# EAGLE schematic single_channel (EAGLE 6.1)
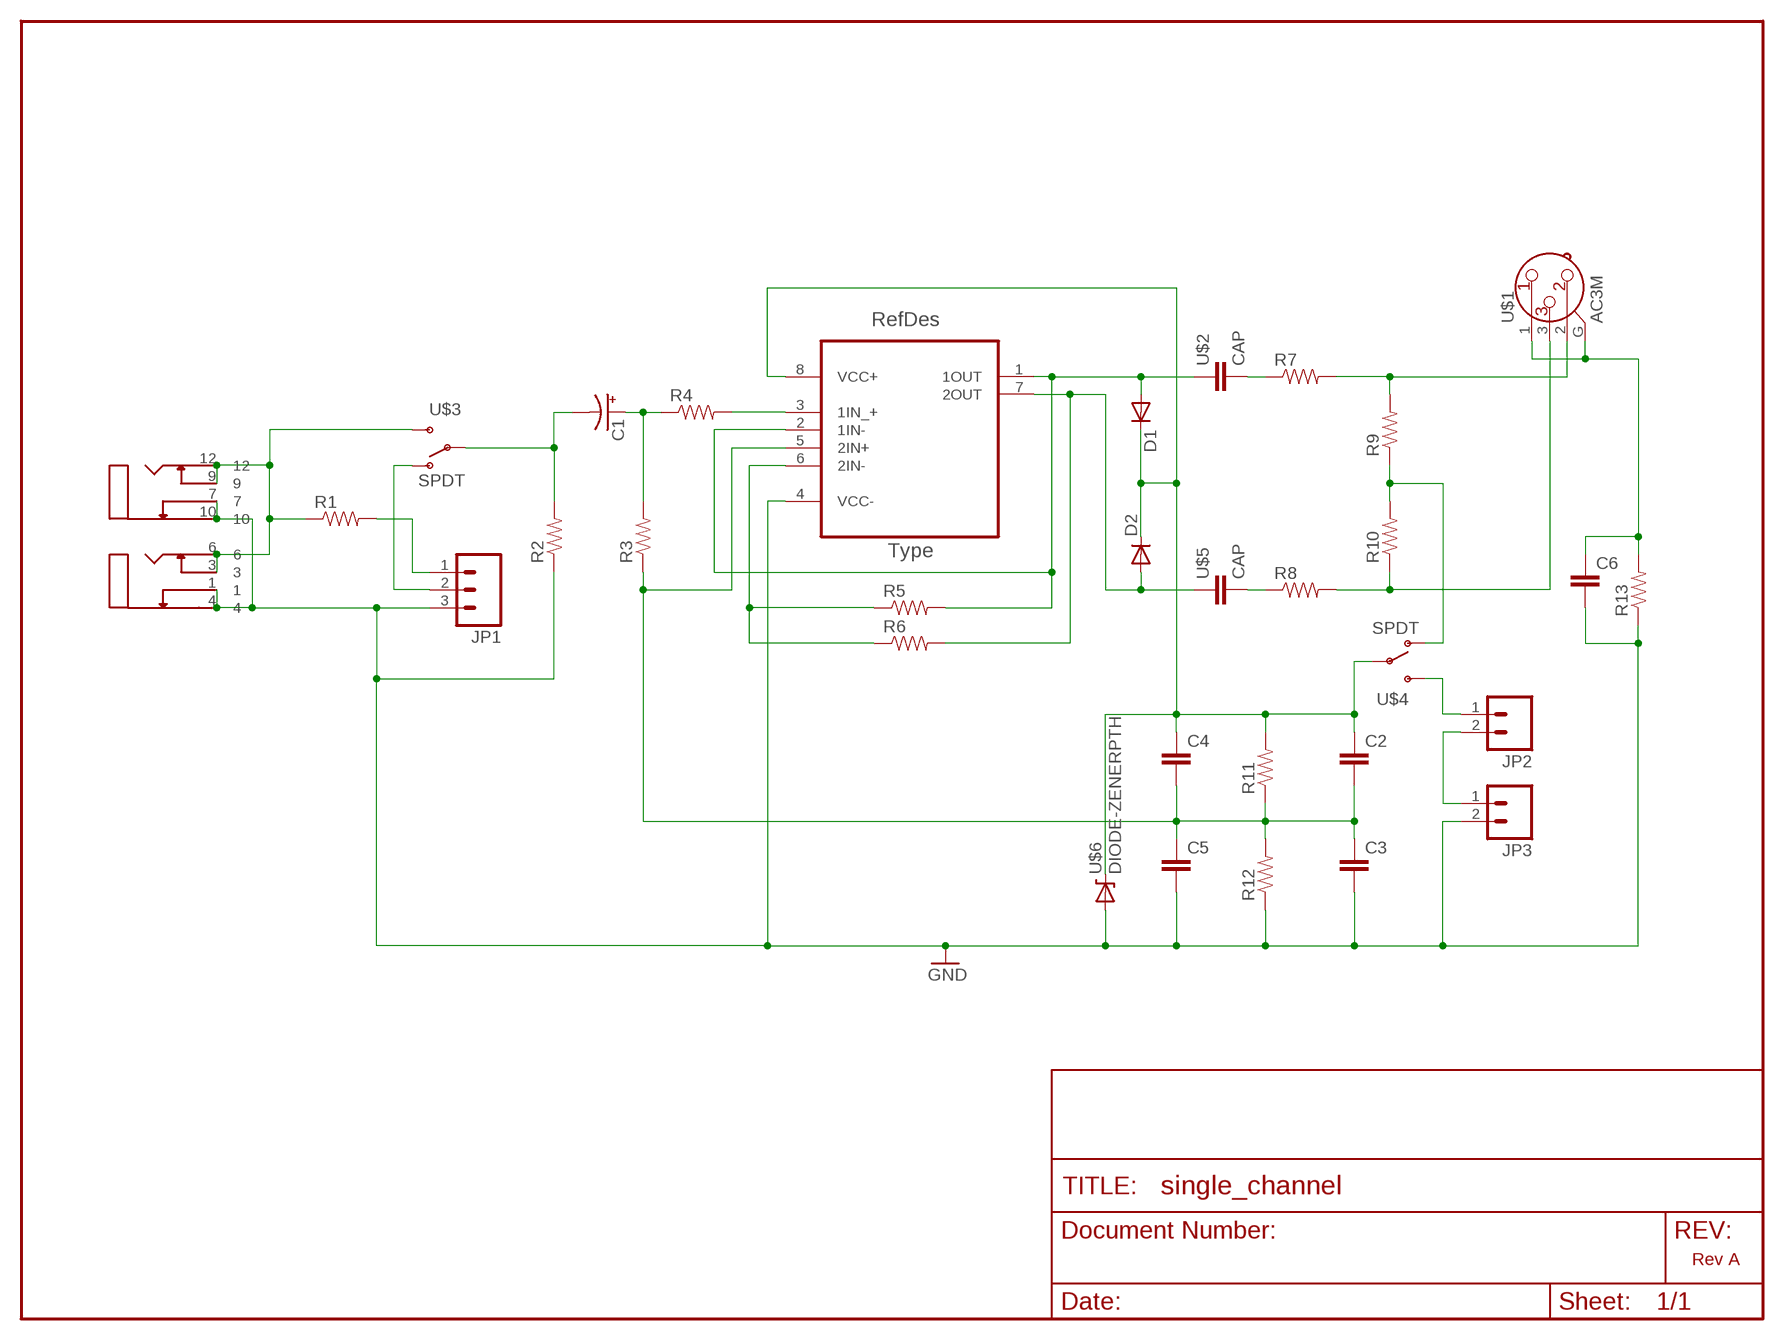
[diagram p0: schematic, sheet 1]

## Parts
C1  CAP_POLPTH2  [CPOL-RADIAL-10UF-25V]
C2  C27/11  [C27.5B11]
C3  C27/11  [C27.5B11]
C4  CAPPTH1  [CAP-PTH-5MM]
C5  CAPPTH1  [CAP-PTH-5MM]
C6  CAPPTH1  [CAP-PTH-5MM]
D1  DIODE1N4148  [DIODE-1N4148]
D2  DIODE1N4148  [DIODE-1N4148]
J1  ACJMMHD  [MHD]
JP1  M03LONGPADS  [1X03_LONGPADS]
JP2  M02PTH3  [1X02_LONGPADS]
JP3  M02PTH3  [1X02_LONGPADS]
R1  RESISTORPTH-1/2W  [AXIAL-0.5]
R2  RESISTORPTH-1/2W  [AXIAL-0.5]
R3  RESISTORPTH-1/2W  [AXIAL-0.5]
R4  RESISTORPTH-1/2W  [AXIAL-0.5]
R5  RESISTORPTH-1/2W  [AXIAL-0.5]
R6  RESISTORPTH-1/2W  [AXIAL-0.5]
R7  RESISTORPTH-1/2W  [AXIAL-0.5]
R8  RESISTORPTH-1/2W  [AXIAL-0.5]
R9  RESISTORPTH-1/2W  [AXIAL-0.5]
R10  RESISTORPTH-1/2W  [AXIAL-0.5]
R11  RESISTORPTH-1/2W  [AXIAL-0.5]
R12  RESISTORPTH-1/2W  [AXIAL-0.5]
R13  RESISTORPTH-1/2W  [AXIAL-0.5]
U1  TL072CP  [DIP254P762X508-8]
U$1  AC3M  [AC3MAH]
U$2  CAP  [C1812]
U$3  SPDT  [SPDT-SLIDE]
U$4  SPDT  [SPDT-SLIDE]
U$5  CAP  [C1812]
U$6  DIODE-ZENERPTH  [DIODE-ZENER]

## Nets
GND: C3.2 C5.2 C6.2 J1.1 J1.4 J1.7 J1.10 JP1.3 JP3.2 R2.P$1 R12.P$1 R13.P$1 U1.4(VCC-) U$6.P$2(A)
N$1: JP1.1 R1.P$2
N$2: J1.3 J1.6 J1.9 J1.12 R1.P$1 U$3.3
N$4: JP1.2 U$3.1
N$5: C1.2(-) R2.P$2 U$3.2
N$6: C1.1(+) R3.P$2 R4.P$1
N$7: D1.A R5.P$2 U1.1(1OUT) U1.2(1IN-) U$2.1
N$8: R4.P$2 U1.3(1IN_+)
N$9: R5.P$1 R6.P$1 U1.6(2IN-)
N$10: C2.2 C3.1 C4.2 C5.1 R3.P$1 R11.P$1 R12.P$2 U1.5(2IN+)
N$11: C2.1 C4.1 D1.C D2.C R11.P$2 U1.8(VCC+) U$4.2 U$6.P$1(C)
N$12: D2.A R6.P$2 U1.7(2OUT) U$5.1
N$13: R8.P$2 R10.P$1 U$1.3
N$14: R9.P$1 R10.P$2 U$4.1
N$15: R7.P$2 R9.P$2 U$1.2
N$16: R7.P$1 U$2.2
N$17: R8.P$1 U$5.2
N$18: JP2.2 JP3.1
N$19: JP2.1 U$4.3
N$20: C6.1 R13.P$2 U$1.1 U$1.G

## Notes on the sheet
- Rev A

## Library data of the parts
C1 = SparkFun:CAP_POL: Capacitor Polarized These are standard SMD and PTH capacitors. Normally 10uF, 47uF, and 100uF in electrolytic and tantalum varieties. Always verify the external diameter of the through hole cap, it varies with capacity, voltage, and manufacturer. The EIA devices should be standard.
C2 C3 = capacitor-wima:C: CAPACITOR naming: grid - package width
C4-C6 = SparkFun:CAP: Capacitor Standard 0603 ceramic capacitor, and 0.1" leaded capacitor.
D1 D2 = SparkFun:DIODE: Diode These are standard reverse protection diodes and small signal diodes. SMA package can handle up to about 1A. SOD-323 can handle about 200mA. What the SOD-323 package when ordering, there are some mfgs out there that are 5-pin packages.
J1 = con-audio:ACJM: ACJM-MHD dual mono 14/" jack plug
JP1 = SparkFun-Connectors:M03: Header 3 Standard 3-pin 0.1" header. Use with straight break away headers (SKU : PRT-00116), right angle break away headers (PRT-00553), swiss pins (PRT-00743), machine pins (PRT-00117), and female headers (PRT-00115). Molex polarized connector foot print use with SKU : PRT-08232 with associated crimp pins and housings.
JP2 JP3 = SparkFun-Connectors:M02: Header 2 Standard 2-pin 0.1" header. Use with straight break away headers (SKU : PRT-00116), right angle break away headers (PRT-00553), swiss pins (PRT-00743), machine pins (PRT-00117), and female headers (PRT-00115). Molex polarized connector foot print use with SKU : PRT-08233 with associated crimp pins and housings.
R1-R13 = SparkFun:RESISTOR: Resistor Basic schematic elements and footprints for 0603, 1206, and PTH resistors.
U1 = ic-amplifiers:TL072CP; DESCRIPTION: OPERATIONAL AMPLIFIER; MPN: TL072CP; OC_FARNELL: 1106015; OC_NEWARK: 60K6988; PACKAGE: PDIP; SUPPLIER: Texas Instruments
U$1 = con-audio:AC3M: Amphenol Male XLR 3 Pin Connector Shield not connected
U$2 U$5 = passive-capacitors:CAP
U$3 U$4 = switches:SPDT
U$6 = SparkFun:DIODE-ZENER: Zener Diode Production Part - 8199 3.4V Zener Voltage